# EAGLE design Qwiic GPS-TwoSided (EAGLE 7.7.0)
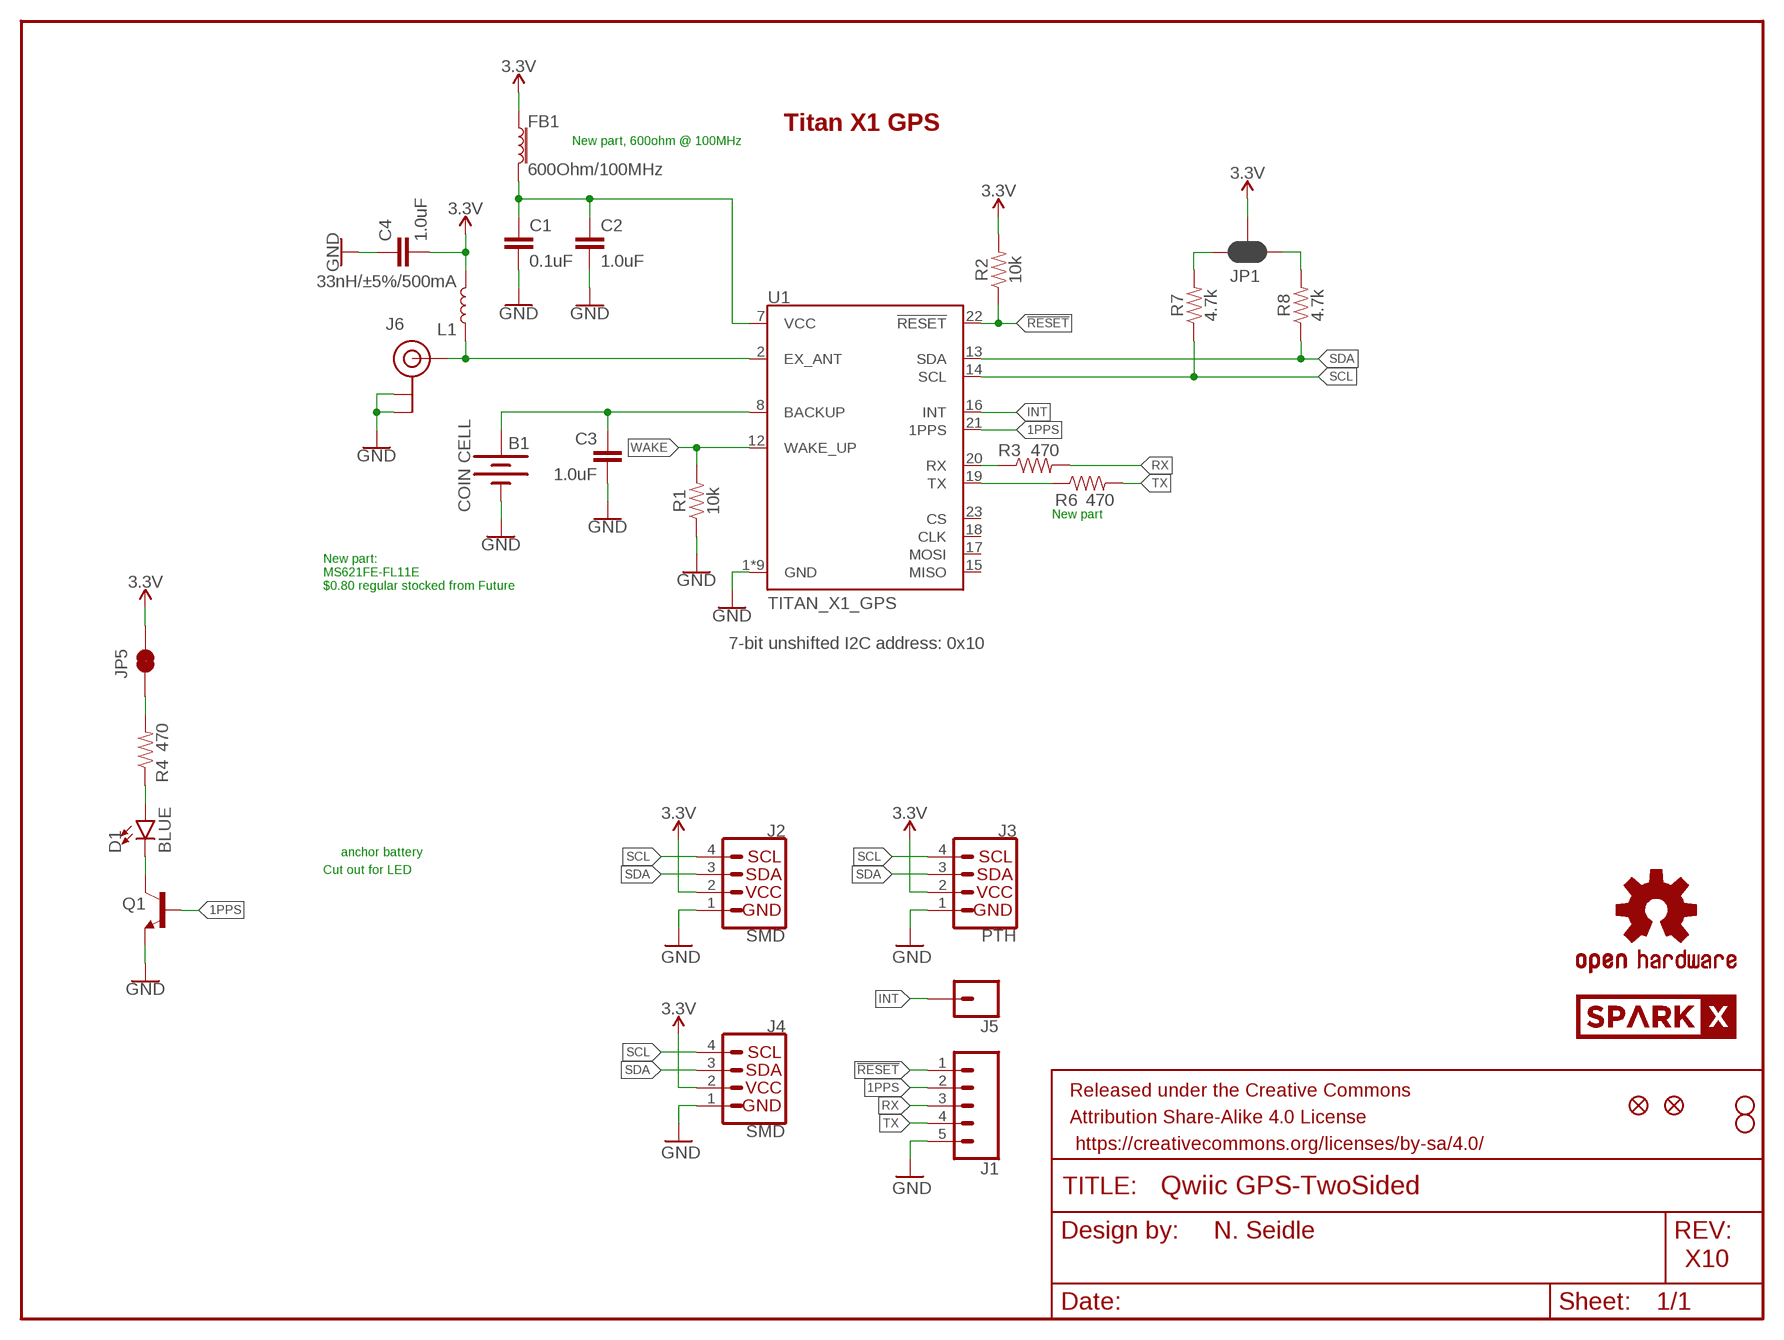
[diagram p0: schematic, sheet 1]

## Parts
B1  COIN CELL  6.8MM_COIN_CELL  [6.8MM_COIN_CELL]
C1  0.1uF  0.1UF-0603-25V-(+80/-20%)  [0603]
C2  1.0uF  1.0UF-0603-16V-10%  [0603]
C3  1.0uF  1.0UF-0603-16V-10%  [0603]
C4  1.0uF  1.0UF-0603-16V-10%  [0603]
D1  BLUE  LED1206-BOTTOM  [LED-1206-BOTTOM]
FB1  600Ohm/100MHz  FERRITE_BEAD-0603  [0603]
FRAME1  FRAME-LETTER  [CREATIVE_COMMONS]
J1  CONN_05NO_SILK  [1X05_NO_SILK]
J2  SMD  I2C_STANDARDJS-1MM  [1X04_1MM_RA]
J3  PTH  I2C_STANDARD_NO_SILK  [1X04_NO_SILK]
J4  SMD  I2C_STANDARDJS-1MM  [1X04_1MM_RA]
J5  CONN_01PTH_NO_SILK_YES_STOP  [1X01_NO_SILK]
J6  U.FL  [U.FL]
JP1  JUMPER-SMT_3_2-NC_PASTE_SILK  [SMT-JUMPER_3_2-NC_PASTE_SILK]
JP2  FIDUCIALUFIDUCIAL  [MICRO-FIDUCIAL]
JP3  STAND-OFF  [STAND-OFF]
JP4  STAND-OFF  [STAND-OFF]
JP5  JUMPER-SMT_2_NC_TRACE_NO-SILK  [SMT-JUMPER_2_NC_TRACE_NO-SILK]
JP6  FIDUCIALUFIDUCIAL  [MICRO-FIDUCIAL]
L1  33nH/±5%/500mA  INDUCTOR-0603-33NH  [0603]
LOGO1  OSHW-LOGOMINI  [OSHW-LOGO-MINI]
Q1  TRANS_NPN-MMBT2222AL  [SOT23-3]
R1  10k  10KOHM-0603-1/10W-1%  [0603]
R2  10k  10KOHM-0603-1/10W-1%  [0603]
R3  470  470OHM-0603-1/10W-1%  [0603]
R4  470  470OHM-0603-1/10W-1%  [0603]
R6  470  470OHM-0603-1/10W-1%  [0603]
R7  4.7k  4.7KOHM-0603-1/10W-1%  [0603]
R8  4.7k  4.7KOHM-0603-1/10W-1%  [0603]
U1  TITAN_X1_GPS  [TITAN_X1_GPS]
U$1  SPARKX-LOGO4  [SPARKX-MEDIUM]
U$2  SPARKX-LOGO4  [SPARKX-MEDIUM]

## Nets
1PPS: J1.2 Q1.1(B) U1.21(1PPS)
3.3V: C4.2 FB1.1 J2.2(VCC) J3.2(VCC) J4.2(VCC) JP1.2 JP5.2 L1.2 R2.2
!RESET: J1.1 R2.1 U1.22(!RESET)
BACKUP: B1.+ C3.1 U1.8(BACKUP)
GND: B1.- C1.2 C2.2 C3.2 C4.1 J1.5 J2.1(GND) J3.1(GND) J4.1(GND) J6.P$1(GND) J6.P$2(GND) Q1.2(E) R1.1 U1.1(GND) U1.3(GND) U1.4(GND) U1.5(GND) U1.6(GND) U1.9(GND) U1.10(GND) U1.11(GND) U1.24(GND)
INT: J5.1 U1.16(INT)
N$1: D1.C Q1.3(C)
N$2: D1.A R4.1
N$3: J6.P$3(SIGNAL) L1.1 U1.2(EX_ANT)
N$4: JP5.1 R4.2
N$5: JP1.1 R8.2
N$7: C1.1 C2.1 FB1.2 U1.7(VCC)
N$8: JP1.3 R7.2
RX: J1.3 R3.2
RXLV: R3.1 U1.20(RX)
SCL: J2.4(SCL) J3.4(SCL) J4.4(SCL) R7.1 U1.14(SCL)
SDA: J2.3(SDA) J3.3(SDA) J4.3(SDA) R8.1 U1.13(SDA)
TX: J1.4 R6.2
TXLV: R6.1 U1.19(TX)
WAKE: R1.2 U1.12(WAKE_UP)
Unconnected: U1.15(MISO) U1.17(MOSI) U1.18(CLK) U1.23(CS)

## Notes on the sheet
- Titan X1 GPS
- New part, 600ohm @ 100MHz
- New part
- New part:
  MS621FE-FL11E
  $0.80 regular stocked from Future
- 7-bit unshifted I2C address: 0x10
- anchor battery
- Cut out for LED
- N. Seidle
- X10

## Library data of the parts
B1 = SparkX:6.8MM_COIN_CELL
C1 = SparkFun-Capacitors:0.1UF: 0.1µF ceramic capacitors A capacitor is a passive two-terminal electrical component used to store electrical energy temporarily in an electric field.; PROD_ID: CAP-00810
C2-C4 = SparkFun-Capacitors:1.0UF: 1µF ceramic capacitors A capacitor is a passive two-terminal electrical component used to store electrical energy temporarily in an electric field.; PROD_ID: CAP-00868
D1 = SparkFun-LED:LED: LED (Generic) Standard schematic elements and footprints for 5mm, 3mm, 1206, and 0603 sized LEDs. Generic LEDs with no color specified.
FB1 = SparkFun-Coils:FERRITE_BEAD: Ferrite Bead (blocks, cores, rings, chokes, etc.) Inductor with layers of ferrite used to suppress high frequencies. Often used to isolate high frequency noise. SparkFun Products: IOIO-OTG - V2.2 <https://www.sparkfun.com/products/13613> SparkFun SAMD21 Mini Breakout <https://www.sparkfun.com/products/13664> SparkFun 6 Degrees of Freedom Breakout - LSM6DS3 <https://www.sparkfun.com/products/13339> SparkFun SAMD21 Dev Breakout <https://www.sparkfun.com/products/13672>; PROD_ID: NDUC-07859; VALUE: 30Ω/1.8A
FRAME1 = SparkFun-Aesthetics:FRAME-LETTER: Schematic Frame - Letter Standard 8.5x11 US Letter frame
J1 = SparkFun-Connectors:CONN_05: Multi connection point. Often used as Generic Header-pin footprint for 0.1 inch spaced/style header connections On any of the 0.1 inch spaced packages, you can populate with these: Break Away Headers - Straight <https://www.sparkfun.com/products/116> (PRT-00116) Break Away Male Headers - Right Angle <https://www.sparkfun.com/products/553> (PRT-00553) Female Headers <https://www.sparkfun.com/products/115> (PRT-00115) Break Away Headers - Machine Pin <https://www.sparkfun.com/products/117> (PRT-00117) Break Away Female Headers - Swiss Machine Pin <https://www.sparkfun.com/products/743> (PRT-00743) For SCREWTERMINALS and SPRING TERMINALS visit here: Screw Terimnals on SparkFun.com <https://www.sparkfun.com/search/results?term=Screw+Terminals> (5mm/3.5mm/2.54mm spacing) This device is also useful as a general connection point to wire up your design to another part of your project. Our various solder wires solder well into these plated through hole pads. Hook-Up Wire - Assortment (Stranded, 22 AWG) <https://www.sparkfun.com/products/11375> (PRT-11375) Hook-Up Wire - Assortment (Solid Core, 22 AWG) <https://www.sparkfun.com/products/11367> (PRT-11367) View the entire wire category on our website here <https://www.sparkfun.com/categories/141> Special notes: Molex polarized connector foot print use with SKU : PRT-08231 with associated crimp pins and housings. 1MM SMD Version SKU: PRT-10208
J2-J4 = SparkX:I2C_STANDARD: SparkFun I2C Standard Pinout Header SparkFun has standardized on a pinout for all I2C based sensor breakouts. This pinout allows I2C boards to be plugged directly into the headers on Arduino Uno compatible boards, and to be daisy chained easily. Example SparkFun Products: SparkFun Atmospheric Sensor Breakout - BME280 <https://www.sparkfun.com/products/13676> SparkFun Altitude/Pressure Sensor Breakout - MPL3115A2 <https://www.sparkfun.com/products/11084> SparkFun TOF Range Finder Sensor - VL6180 <https://www.sparkfun.com/products/12785>
J5 = SparkFun-Connectors:CONN_01: Single connection point. Often used as Generic Header-pin footprint for 0.1 inch spaced/style header connections On any of the 0.1 inch spaced packages, you can populate with these: Break Away Headers - Straight <https://www.sparkfun.com/products/116> (PRT-00116) Break Away Male Headers - Right Angle <https://www.sparkfun.com/products/553> (PRT-00553) Female Headers <https://www.sparkfun.com/products/115> (PRT-00115) Break Away Headers - Machine Pin <https://www.sparkfun.com/products/117> (PRT-00117) Break Away Female Headers - Swiss Machine Pin <https://www.sparkfun.com/products/743> (PRT-00743) This device is also useful as a general connection point to wire up your design to another part of your project. Our various solder wires solder well into these plated through hole pads. Hook-Up Wire - Assortment (Stranded, 22 AWG) <https://www.sparkfun.com/products/11375> (PRT-11375) Hook-Up Wire - Assortment (Solid Core, 22 AWG) <https://www.sparkfun.com/products/11367> (PRT-11367) View the entire wire category on our website here <https://www.sparkfun.com/categories/141> Special notes: SMTSO-256-ET is a "flush mount" nut for a 4-40 screw. We mostly use this on specialty testbeds; it is a nice way to connect hardware to your PCB at an adjustable hieght. Also note, the SNAP packages are for using a snappable style connector. We sell a baggie of snaps and they are also used on two LilyPad designs: Snap Assortment - 30 pack (male and female) <https://www.sparkfun.com/products/11347> (DEV-11347) LilyPad Arduino SimpleSnap <https://www.sparkfun.com/products/10941> (DEV-10941) LilyPad SimpleSnap Protoboard <https://www.sparkfun.com/products/10940> (DEV-10940)
J6 = SparkFun-Connectors:U.FL: SMD Antenna Connector - U.FL 2mm height, 3.0mm x 3.0mm receptacle size. SparkFun Products: SparkFun WiFi Shield - ESP8266 <https://www.sparkfun.com/products/13287> SparkFun ESP8266 Thing <https://www.sparkfun.com/products/13231> SparkFun MiniGen - Pro Mini Signal Generator Shield <https://www.sparkfun.com/products/11420>; PROD_ID: CONN-09193; SF_ID: WRL-09144
JP1 = SparkFun-Jumpers:JUMPER-SMT_3_2-NC_PASTE: Normally closed solder jumper (2 of 2 connections) This jumper has an aperture in the stencil to allow solder paste to bridge both connections. Both connections are normally closed (NC). Wick off the solder to open the connection(s). Reapply solder to reclose the connection(s).
JP2 JP6 = SparkFun:FIDUCIAL: Fiducial Alignment Points Various fiducial points for machine vision alignment.
JP3 JP4 = SparkFun:STAND-OFF: Stand Off This is the mechanical footprint for a #4 phillips button head screw. Use the keepout ring to avoid running the screw head into surrounding components. SKU : PRT-00447
JP5 = SparkFun-Jumpers:JUMPER-SMT_2_NC_TRACE: Normally closed trace jumper This jumper has a trace between two pads so it's normally closed (NC). Use a razor knife to open the connection. For best results follow the IPC guidelines for cutting traces: Cutout at least 0.063 mm (0.005 in). Remove all loose material to clean up the cut area. Seal the cut with an approved epoxy. Reapply solder to reclose the connection.
L1 = SparkFun-Coils:INDUCTOR: Inductors Resist changes in electrical current. Basically a coil of wire. SparkFun Products: SparkFun Load Cell Amplifier - HX711 <https://www.sparkfun.com/products/13879> IOIO-OTG - V2.2 <https://www.sparkfun.com/products/13613>; PROD_ID: NDUC-07874
LOGO1 = SparkFun-Aesthetics:OSHW-LOGO: Open-Source Hardware (OSHW) Logo This logo indicates the piece of hardware it is found on incorporates a OSHW license and/or adheres to the definition of open source hardware found here: http://freedomdefined.org/OSHW
Q1 = SparkFun-DiscreteSemi:TRANS_NPN: NPN transistor Current controlled devices typically used to amplify current or used as a switch. BC547 - COM-08928 <http://www.sparkfun.com/products/8928> (TO-92 45V 100mA) (1.Collector 2.Base 3.Emitter) 2N3904 - COM-00521 <http://www.sparkfun.com/products/521> (TO-92 40V 200mA) (1.Emitter 2.Base 3.Collector) P2N2222A - COM-12852 <http://www.sparkfun.com/products/12852> (TO-92 40V 600mA) (1.Collector 2.Base 3.Emitter); PROD_ID: TRANS-08049; VALUE: 600mA/40V
R1 R2 = SparkFun-Resistors:10KOHM: 10kΩ resistor A resistor is a passive two-terminal electrical component that implements electrical resistance as a circuit element. Resistors act to reduce current flow, and, at the same time, act to lower voltage levels within circuits. - Wikipedia; PROD_ID: RES-00824
R3 R4 R6 = SparkFun-Resistors:470OHM: 470Ω resistor A resistor is a passive two-terminal electrical component that implements electrical resistance as a circuit element. Resistors act to reduce current flow, and, at the same time, act to lower voltage levels within circuits. - Wikipedia; PROD_ID: RES-07869
R7 R8 = SparkFun-Resistors:4.7KOHM: 4.7kΩ resistor A resistor is a passive two-terminal electrical component that implements electrical resistance as a circuit element. Resistors act to reduce current flow, and, at the same time, act to lower voltage levels within circuits. - Wikipedia; PROD_ID: RES-07857
U1 = SparkX:TITAN_X1_GPS
U$1 U$2 = SparkX:SPARKX-LOGO

## Board
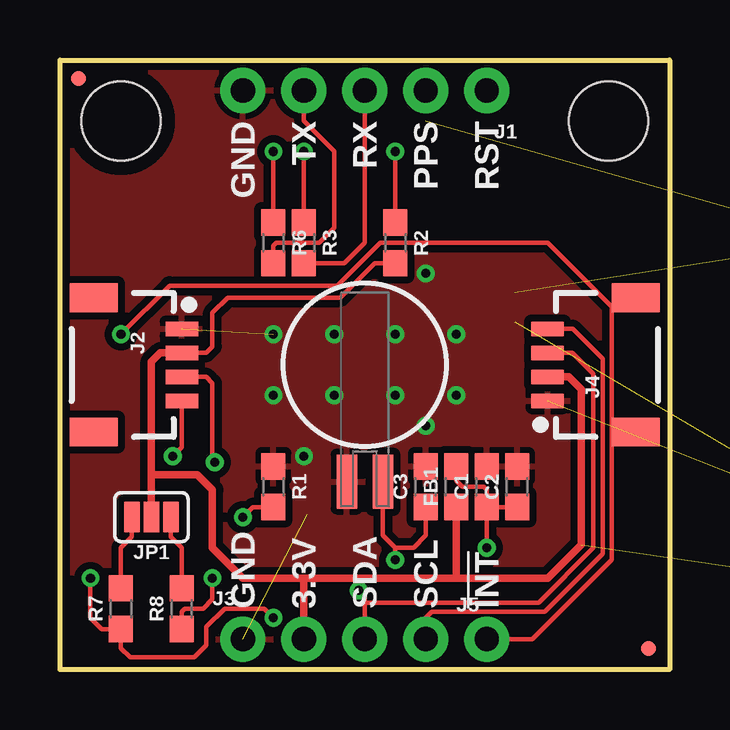
[diagram p1: board, top side]
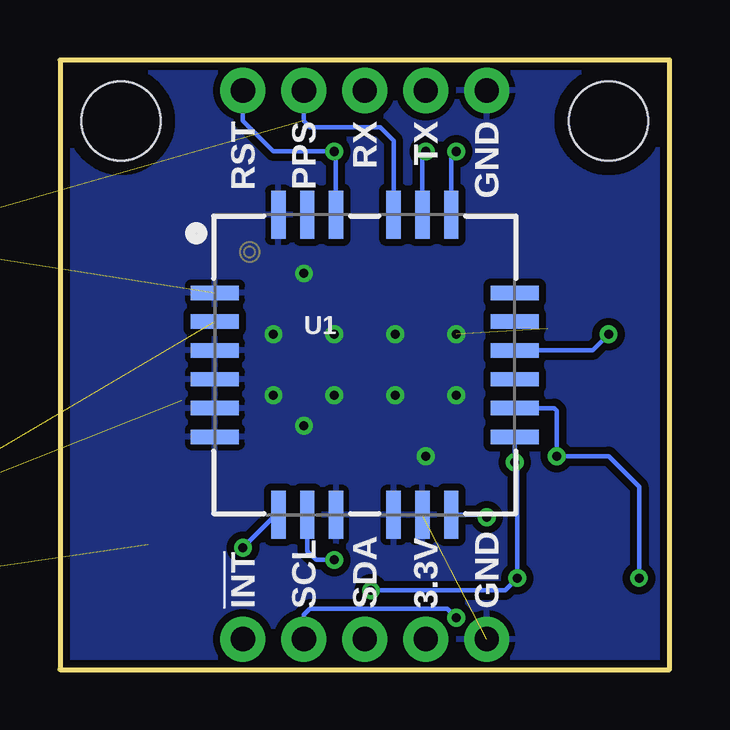
[diagram p2: board, bottom side, seen from below]

Size 25.4 x 25.4 mm. Coordinates in mm from the lower left corner, seen from the top.
Outline: 0,0 0,25.4 25.4,25.4 25.4,0 0,0
Copper layers (1*16): Top 0.035mm / dielectric 1.5mm / Bottom 0.035mm
Design rules "SparkFun-2-layer-TIGHT": minimum track width 7mil, minimum drill 15mil, track to track 7mil, track to pad 7mil, pad to pad 7mil, via to via 7mil, smd to smd 7mil, copper to edge 7mil, drill to drill 7mil, minimum pad ring 7mil, minimum via ring 7mil, stop-mask expansion 4mil, vias tented up to drill 25mil, thermal gap 10mil

### Footprints (pad centres in the part's own frame; a part is rotated, then mirrored left to right if it is on the bottom)
6.8MM_COIN_CELL = smd 2.25 x 0.85: + 4.87,0.75; - 4.87,-0.75
0603 = smd 1.1 x 1: 1 -0.85,0; 2 0.85,0
LED-1206-BOTTOM = smd 1.5 x 1.6: A -1.8,0; C 1.8,0 | hole 2.3: 0,0
1X05_NO_SILK = drill 1.016 pad 1.88: 1 0,0; 2 2.54,0; 3 5.08,0; 4 7.62,0; 5 10.16,0
1X04_1MM_RA = smd 0.6 x 1.35: 1 -1.5,0; 2 -0.5,0; 3 0.5,0; 4 1.5,0 | smd 1.2 x 2: NC1 2.8,-3.675; NC2 -2.8,-3.675
1X04_NO_SILK = drill 1.016 pad 1.88: 1 0,0; 2 2.54,0; 3 5.08,0; 4 7.62,0
1X01_NO_SILK = drill 1.016 pad 1.88: 1 0,0
U.FL = smd 2.2 x 0.85: P$1 0,1.375; P$2 0,-1.375 | smd 1.05 x 1: P$3 1.525,0; P$4 -1.525,0
SMT-JUMPER_3_2-NC_PASTE_SILK = smd 0.635 x 1.27: 1 -0.813,0; 2 0,0; 3 0.813,0
MICRO-FIDUCIAL = smd 0.635 x 0.635: 1 0,0
STAND-OFF = hole 3.302: 0,0
SMT-JUMPER_2_NC_TRACE_NO-SILK = smd 0.635 x 1.27: 1 -0.508,0; 2 0.508,0
SOT23-3 = smd 0.8 x 0.9: 1 -0.95,-1; 2 0.95,-1; 3 0,1.1
TITAN_X1_GPS = smd 2 x 0.6: 1 -6.25,3; 2 -6.25,1.8; 3 -6.25,0.6; 4 -6.25,-0.6; 5 -6.25,-1.8; 6 -6.25,-3; 13 6.25,-3; 14 6.25,-1.8; 15 6.25,-0.6; 16 6.25,0.6; 17 6.25,1.8; 18 6.25,3 | smd 0.6 x 2: 7 -3.6,-6.25; 8 -2.4,-6.25; 9 -1.2,-6.25; 10 1.2,-6.25; 11 2.4,-6.25; 12 3.6,-6.25; 19 3.6,6.25; 20 2.4,6.25; 21 1.2,6.25; 22 -1.2,6.25; 23 -2.4,6.25; 24 -3.6,6.25

### Placement (x,y rotation side)
B1  12.7,12.7 270 top
C1  17.78,7.62 90 top
C2  19.05,7.62 90 top
C3  15.24,7.62 90 top
C4  33.02,0 0 top  (outside the outline)
D1  31.75,12.7 0 top  (outside the outline)
FB1  16.51,7.62 90 top
FRAME1  -20.32,-17.78 0 top  (outside the outline)
J1  17.78,24.13 180 top
J2  5.08,12.7 270 top
J3  7.62,1.27 0 top
J4  20.32,12.7 90 top
J5  17.78,1.27 0 top
J6  35.56,3.81 0 top  (outside the outline)
JP1  3.81,6.35 180 top
JP2  24.51,0.89 0 top
JP3  2.54,22.86 0 top
JP4  22.86,22.86 0 top
JP5  33.02,7.62 0 top  (outside the outline)
JP6  0.76,24.64 0 top
L1  30.48,3.81 0 top  (outside the outline)
LOGO1  -7.62,6.35 0 bottom  (outside the outline)
Q1  33.02,19.05 0 top  (outside the outline)
R1  8.89,7.62 270 top
R2  13.97,17.78 270 top
R3  10.16,17.78 270 top
R4  33.02,10.16 0 top  (outside the outline)
R6  8.89,17.78 270 top
R7  2.54,2.54 90 top
R8  5.08,2.54 90 top
U1  12.7,12.7 0 bottom
U$1  -11.43,32.38 0 bottom  (outside the outline)
U$2  -13.97,32.38 0 top  (outside the outline)

### Tracks (layer width: path | path; a pad name or v marks a point on that pad's centre or on a via)
1PPS  (1 unrouted)
  Bottom 0.178: U1.21 11.5,22.04 12.06,22.61 14.99,22.61 15.24,22.86 J1.2
3.3V  (3 unrouted)
  Top 0.178: R2.2 13.12,16.93 11.68,15.49 6.99,15.49 6.35,14.86 6.35,13.46 6.09,13.2 J2.2
  Top 0.305: J4.2 21.2,12.2 21.72,11.68 21.72,5.21 20.32,3.81 16.51,3.81 | 16.51,3.81 10.16,3.81 | 10.16,3.81 7.62,3.81 6.35,5.08 6.35,7.49 5.71,8.13 3.81,8.13 | J3.2 10.16,3.81 | FB1.1 16.51,3.81 | JP1.2 3.81,8.13 | 3.81,8.13 3.81,12.83 4.18,13.2 J2.2
!RESET  (via drill 0.38)
  Top 0.178: R2.1 v13.97,21.59
  Bottom 0.178: U1.22 13.9,21.52 v13.97,21.59 16.51,21.59 17.78,22.86 J1.1
BACKUP  (via drill 0.38)
  Top 0.178: B1.+ 13.45,5.6 13.97,5.08 | v13.97,4.57 13.97,5.08 | C3.1 15.24,5.59 14.73,5.08 13.97,5.08
  Bottom 0.178: U1.8 15.1,4.94 14.73,4.57 v13.97,4.57
GND  (via drill 0.38)  (6 unrouted)
  other vias: 16.51,13.97 16.51,11.43 15.24,10.16 15.24,16.51 13.97,13.97 13.97,11.43 11.43,11.43 11.43,13.97 8.89,13.97 8.89,11.43 10.16,8.89
  pour Bottom (isolate 0.305): 0,0 0,25.4 25.4,25.4 25.4,0
  pour Top (isolate 0.305): 0,0 0,25.4 25.4,25.4 25.4,0
INT  (via drill 0.38)
  Top 0.178: J5.1 19.68,1.27 22.99,4.57 22.99,15.11 20.32,17.78 13.34,17.78 11.56,16 4.57,16 v2.54,13.97
  Bottom 0.178: U1.16 3.21,13.3 v2.54,13.97
N$1  (1 unrouted)
N$2  (1 unrouted)
N$3  (2 unrouted)
N$4  (1 unrouted)
N$5
  Top 0.178: JP1.1 4.62,5.54 5.08,5.08 R8.2
N$7  (via drill 0.38)
  Top 0.178: C1.1 C2.1 | C1.1 v17.78,5.08 | FB1.2 16.51,7.87 16.76,7.62 17.65,7.62 17.78,7.49 C1.1
  Bottom 0.178: U1.7 16.41,6.45 v17.78,5.08
N$8
  Top 0.178: JP1.3 3,5.54 2.54,5.08 R7.2
RX
  Top 0.178: R3.2 11.85,16.93 12.7,17.78 J1.3
RXLV  (via drill 0.38)
  Top 0.178: R3.1 v10.16,21.59
  Bottom 0.178: U1.20 10.3,21.45 v10.16,21.59
SCL  (via drill 0.38)
  Top 0.178: J2.4 5.08,9.27 v4.7,8.89 | v1.27,3.81 1.27,2.16 1.74,1.69 R7.1 2.54,0.89 2.92,0.51 5.59,0.51 6.1,1.02 6.1,1.78 6.86,2.54 8.51,2.54 v8.89,2.16 | J4.4 21.36,14.2 22.61,12.95 22.61,4.83 20.19,2.41 15.49,2.41 15.24,2.16 J3.4
  Bottom 0.178: U1.14 4.8,10.9 4.7,10.79 v4.7,8.89 2.54,8.89 1.27,7.62 v1.27,3.81 | J3.4 15.24,2.29 14.99,2.54 9.27,2.54 v8.89,2.16
SDA  (via drill 0.38)
  Top 0.178: J4.3 21.34,13.2 22.23,12.32 22.23,5.08 19.94,2.79 12.7,2.79 | J2.3 6.09,12.2 6.35,11.94 6.35,8.74 v6.45,8.64 | J3.3 12.7,2.79 | 12.7,2.79 12.7,3.05 v12.45,3.3 | R8.1 5.08,2.41 5.21,2.54 5.97,2.54 6.35,2.92 v6.35,3.81
  Bottom 0.178: U1.13 v6.45,8.64 6.35,8.54 v6.35,3.81 6.86,3.3 v12.45,3.3
TX
  Top 0.178: R6.2 8.89,17.65 9.02,17.78 10.79,17.78 11.43,18.41 11.43,21.59 10.16,22.86 J1.4
TXLV  (via drill 0.38)
  Top 0.178: R6.1 v8.89,21.59
  Bottom 0.178: U1.19 9.1,21.38 v8.89,21.59
WAKE  (via drill 0.38)
  Top 0.178: R1.2 8.04,6.77 v7.62,6.35
  Bottom 0.178: U1.12 7.72,6.45 v7.62,6.35

### Text on the board
Bottom: X10
tPlace: Qwiic GPS | GND | TX | RX | PPS | RST | GND | 3.3V | SDA | SCL | !INT
bPlace: GND | TX | RX | PPS | RST | GND | 3.3V | SDA | SCL | !INT